# Altium schematic sheet PSU_ADM660AR_DOUBLER.SchDoc: PSU ADM660AR Voltage Doubler
size A4; Organization: Altium Limited.; Address1: Level 3, 12a Rodborough Rd; Address2: Frenchs Forest 2086; Address3: NSW; Address4: AUSTRALIA; Revision: 6; SheetNumber: 34; SheetTotal: 64
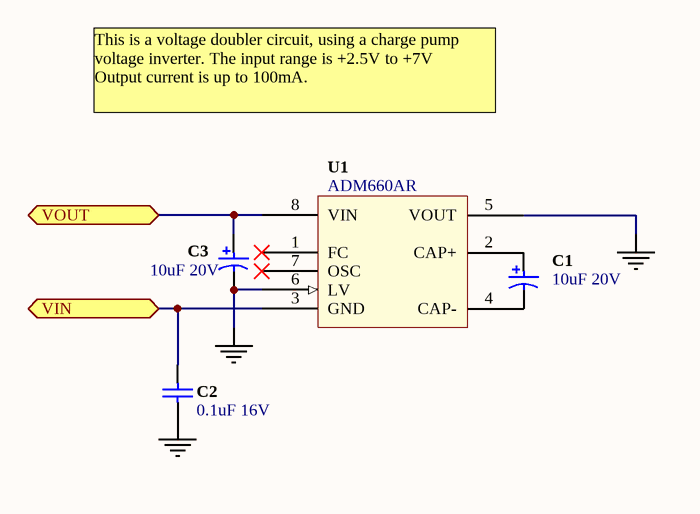
[diagram p0: PSU_ADM660AR_DOUBLER.SchDoc]

## Parts
C1  10uF 20V  [CAPC3528-STAR]
C2  0.1uF 16V  [CAPC1005-STAR]
C3  10uF 20V  [CAPC3528-STAR]
U1  ADM660AR  [SOIC127P600-8]

## Ports
VIN, VOUT

## Nets
GND: C2.2 C3.2 U1.5(VOUT) U1.6(LV)
VIN: C2.1 U1.3(GND) ; port VIN
VOUT: C3.1 U1.8(VIN) ; port VOUT
NetC1_1: C1.1 U1.2(CAP+)
NetC1_2: C1.2 U1.4(CAP-)

Not connected (* = marked no-connect by the designer): U1 1(FC)* 7(OSC)*

## Notes on the sheet
- This is a voltage doubler circuit, using a charge pump voltage inverter. The input range is +2.5V to +7V
  Output current is up to 100mA.
- Sheet Title
- Project Title
- Size:
- Date:
- A4
- Assy:
- Time:
- Sheet
- Revision:
- of
- File:

## Library data of the parts
C1 C3 = D-101-0007: Capacitor, Tantalum, 10uF 10% 20V MCCT-B (3528); Polarity: Polarized; Category: Capacitor; Capacitance: 10 uF; Mounting Technology: Surface Mount; Rated Voltage: 20 V; Status: Production; Technology: Tantalum; Tolerance: 10 %
C2 = D-101-0080: Capacitor, Ceramic, 0.1uF 10% 16V 0402 (1005) X7R; Polarity: Non-Polarized; Category: Capacitor; Capacitance: 0.1 uF; Dielectric: X7R; Mounting Technology: Surface Mount; Rated Voltage: 16 V; Status: Production; Technology: Ceramic; Tolerance: 10 %
U1 = D-204-0009: ADM660AR, Switched-Capacitor Voltage Converter/Inverter, 1.5-7V, 100mA, SO8; Max Input Voltage: 7.0 V; Max Output Voltage: -3.0 V; Min Input Voltage: 1.5 V; Min Output Voltage: -14.0 V; Supply Voltage: mV; Category: IC-Power; Max Output Current: 100 mA; Mounting Technology: Surface Mount; Status: Unreleased